# Altium schematic sheet SCC1002_IO.SchDoc
size A4; DrawnBy: Marco
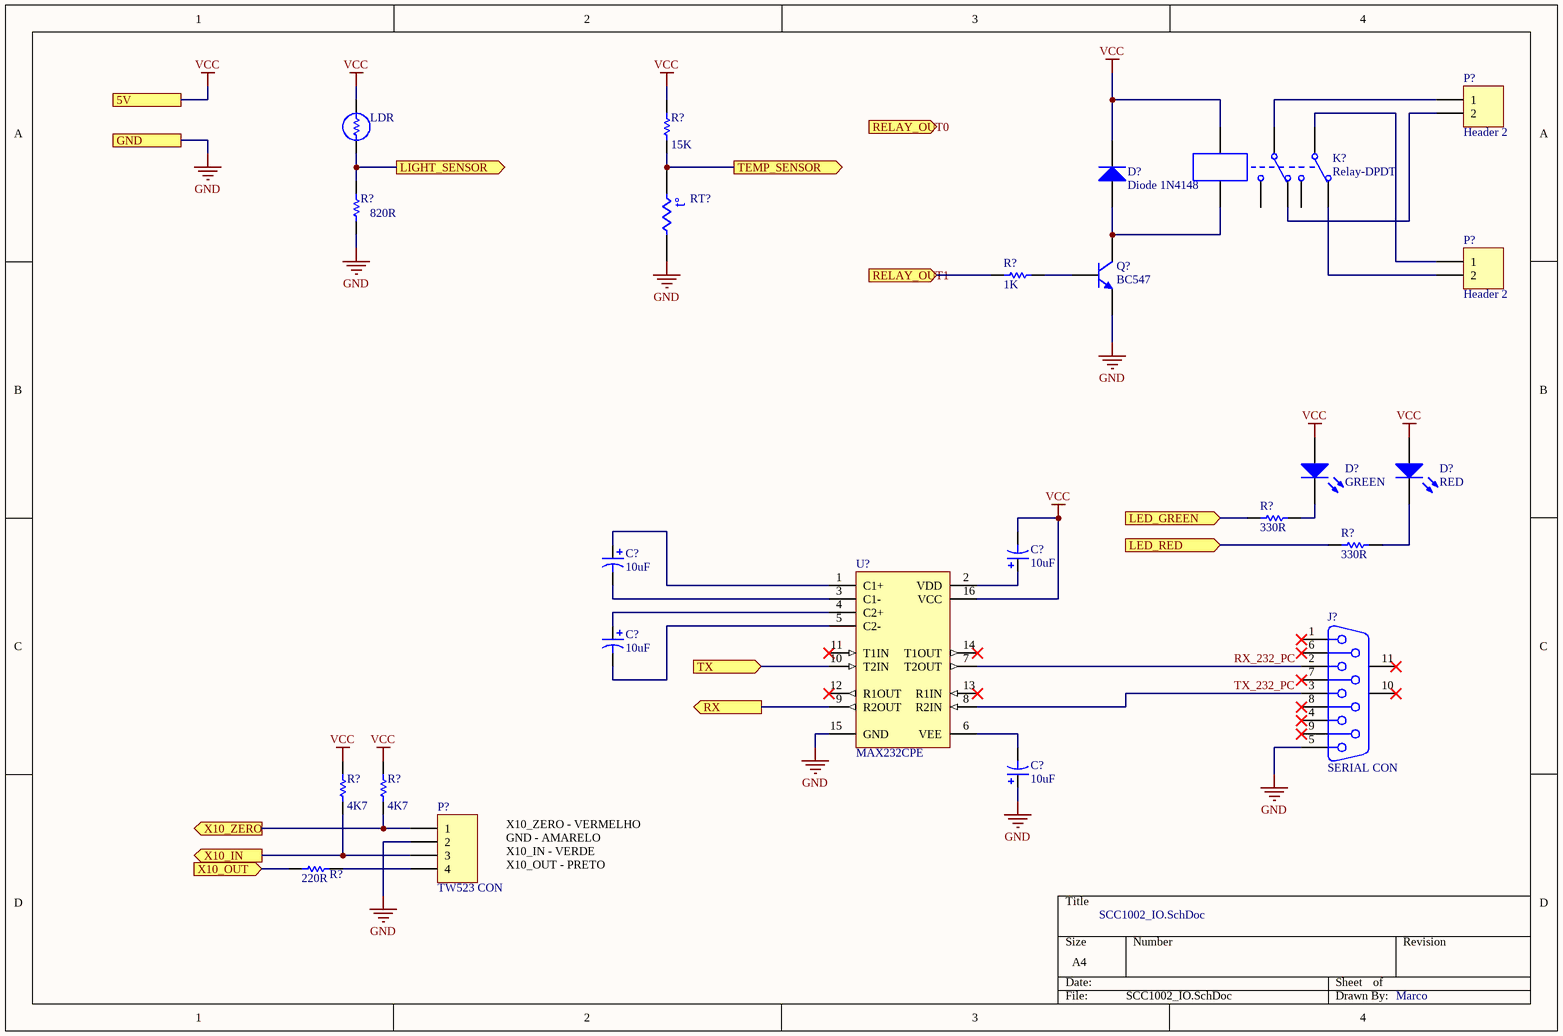
[diagram p0: SCC1002_IO.SchDoc]

## Parts
(Parts that share a designator on the sheet are numbered #1, #2 ... from top to bottom, then left to right.)
C?#1  value 10uF  [RB7.6-15]  (hidden comment: Cap Pol1)
C?#2  value 10uF  [RB7.6-15]  (hidden comment: Cap Pol1)
C?#3  value 10uF  [RB7.6-15]  (hidden comment: Cap Pol1)
C?#4  value 10uF  [RB7.6-15]  (hidden comment: Cap Pol1)
D?#1  Diode 1N4148  [DO-35]
D?#2  GREEN  [3.2X1.6X1.1]
D?#3  RED  [3.2X1.6X1.1]
J?  SERIAL CON  [DSUB1.385-2H9]
K?  Relay-DPDT  [DIP-P8]
LDR  LDR  (value not drawn)
P?#1  Header 2  [HDR1X2]
P?#2  Header 2  [HDR1X2]
P?#3  TW523 CON  [HDR1X4]
Q?  BC547  [TO-92A]
R?#1  value 15K  [AXIAL-0.3]  (hidden comment: Res1)
R?#2  value 820R  [AXIAL-0.3]  (hidden comment: Res1)
R?#3  value 1K  [AXIAL-0.3]  (hidden comment: Res1)
R?#4  value 330R  [AXIAL-0.3]  (hidden comment: Res1)
R?#5  value 330R  [AXIAL-0.3]  (hidden comment: Res1)
R?#6  value 4K7  [AXIAL-0.3]  (hidden comment: Res1)
R?#7  value 4K7  [AXIAL-0.3]  (hidden comment: Res1)
R?#8  value 220R  [AXIAL-0.3]  (hidden comment: Res1)
RT?  Res Thermal  [6-0805_N]  (value not drawn)
U?  MAX232CPE  [PE16A]

## Ports
5V, GND, LED_GREEN (in), LED_RED (in), LIGHT_SENSOR (out), RELAY_OUT0 (in), RELAY_OUT1 (in), RX (out), TEMP_SENSOR (out), TX (in), X10_IN (out), X10_OUT (in), X10_ZERO (out)

## Nets
GND: C?#4.1 J?.5 P?#3.2 Q?.1(E) R?#2.1 RT?.2 U?.15(GND) ; port GND
VCC: C?#2.2 D?#1.2(K) D?#2.1(A) D?#3.1(A) K?.7 LDR.2 R?#1.2 R?#6.2 R?#7.2 U?.16(VCC) ; port 5V
LED_GREEN: R?#4.2 ; port LED_GREEN
LED_RED: R?#5.2 ; port LED_RED
LIGHT_SENSOR: LDR.1 R?#2.2 ; port LIGHT_SENSOR
RELAY_OUT1: R?#3.2 ; port RELAY_OUT1
RX: U?.9(R2OUT) ; port RX
RX_232_PC: J?.2 U?.7(T2OUT)
TEMP_SENSOR: R?#1.1 RT?.1 ; port TEMP_SENSOR
TX: U?.10(T2IN) ; port TX
TX_232_PC: J?.3 U?.8(R2IN)
X10_IN: P?#3.3 R?#6.1 ; port X10_IN
X10_OUT: R?#8.2 ; port X10_OUT
X10_ZERO: P?#3.1 R?#7.1 ; port X10_ZERO
NetC?#1_1: C?#1.1 U?.1(C1+)
NetC?#1_2: C?#1.2 U?.3(C1-)
NetC?#2_1: C?#2.1 U?.2(VDD)
NetC?#3_1: C?#3.1 U?.4(C2+)
NetC?#3_2: C?#3.2 U?.5(C2-)
NetC?#4_2: C?#4.2 U?.6(VEE)
NetD?#1_1: D?#1.1(A) K?.8 Q?.3(C)
NetD?#2_2: D?#2.2(K) R?#4.1
NetD?#3_2: D?#3.2(K) R?#5.1
NetK?_1: K?.1 P?#2.1
NetK?_2: K?.2 P?#2.2
NetK?_4: K?.4 P?#1.1
NetK?_5: K?.5 P?#1.2
NetP?#3_4: P?#3.4 R?#8.1
NetQ?_2: Q?.2(B) R?#3.1

Not connected (* = marked no-connect by the designer): J? 1* 4* 6* 7* 8* 9* 10(MH1)* 11(MH2)*; K? 3 6; U? 11(T1IN)* 12(R1OUT)* 13(R1IN)* 14(T1OUT)*

## Notes on the sheet
- X10_ZERO - VERMELHO
  GND - AMARELO
  X10_IN - VERDE
  X10_OUT - PRETO
- (in symbol Res Thermal) t°

## Library data of the parts
C?#1-C?#4 = Cap Pol1: Polarized Capacitor (Radial); Published: 8-Jun-2000; LatestRevisionDate: 17-Jul-2002; LatestRevisionNote: Re-released for DXP Platform.; PackageReference: RB7.6-15; Publisher: Altium Limited; PackageDescription: Polarized Capacitor (Radial); 2 Leads
D?#1 = Diode 1N4148: High Conductance Fast Diode; Published: 8-Jun-2000; LatestRevisionDate: 17-Jul-2002; LatestRevisionNote: Re-released for DXP Platform.; DatasheetVersion: 1997; PackageReference: DO-35; Publisher: Altium Limited; PackageDescription: Diode, Axial; Body 3.8 x 1.9 mm (LxDia. max), Lead Dia. 0.53 mm (max); Code_JEDEC: DO-204-AH; ComponentLink1Description: Manufacturer Link; ComponentLink1URL: http://www.fairchildsemi.com/; ComponentLink2Description: Datasheet; ComponentLink2URL: http://www.fairchildsemi.com/ds/1N%2F1N4148.pdf
D?#2 D?#3 = LED2: Typical RED, GREEN, YELLOW, AMBER GaAs LED; Published: 8-Jun-2000; LatestRevisionDate: 17-Jul-2002; LatestRevisionNote: Re-released for DXP Platform.; PackageVersion: Feb-2002; PackageReference: 3.2X1.6X1.1; Publisher: Altium Limited; PackageDescription: SM LED; 2 Flat Leads
J? = D Connector 9: Receptacle Assembly, 9 Position, Right Angle; PackageDocument: O; Positions: 9; Published: 15-Jun-2001; LatestRevisionDate: 17-Jul-2002; LatestRevisionNote: Re-released for DXP Platform.; DatasheetDocument: 1-Sep-1999; PackageReference: 788750; Publisher: Altium Limited; Orientation: Right Angle; Gender: Receptacle
K? = Relay-DPDT: Dual-Pole Dual-Throw Relay; Published: 24-Mar-1999; LatestRevisionDate: 17-Jul-2002; LatestRevisionNote: Re-released for DXP Platform.; PackageReference: DIP-P8; Publisher: Altium Limited; PackageDescription: Relay; 8 Leads
LDR = LDR: Light Dependent Resistor
P?#1 P?#2 = Header 2: Header, 2-Pin; LatestRevisionDate: 17-Jul-2002; LatestRevisionNote: Re-released for DXP Platform.; Publisher: Altium Limited
P?#3 = Header 4: Header, 4-Pin; LatestRevisionDate: 17-Jul-2002; LatestRevisionNote: Re-released for DXP Platform.; Publisher: Altium Limited
Q? = 2N3904: NPN General Purpose Amplifier; Published: 8-Jun-2000; LatestRevisionDate: 15-Jan-2003; LatestRevisionNote: PCB Footprint 'BCY-W3/D4.7' replaced; DatasheetVersion: 1997; PackageVersion: Sep-1998; PackageReference: TO-92A; Publisher: Altium Limited; PackageDescription: TO, Flat Index; 3 In-Line, Axial Leads; Body Dia. 4.5mm; Leads 0.51 x 0.48 mm (max); ComponentLink1Description: Manufacturer Link; ComponentLink1URL: http://www.fairchildsemi.com/; ComponentLink2Description: Datasheet; ComponentLink2URL: http://www.fairchildsemi.com/ds/2N%2F2N3904.pdf
R?#1-R?#8 = Res1: Resistor; Published: 8-Jun-2000; LatestRevisionDate: 17-Jul-2002; LatestRevisionNote: Re-released for DXP Platform.; PackageReference: AXIAL-0.3; Publisher: Altium Limited; PackageDescription: Axial Device, Thru-Hole; 2 Leads; 0.3 in Pin Spacing
RT? = Res Thermal: Thermistor; Published: 24-Mar-1999; LatestRevisionDate: 29-May-2009; LatestRevisionNote: IPC-7351 Footprint Added.; PackageVersion: Mar-2003; PackageReference: 6-0805; Publisher: Altium Limited; PackageDescription: Chip Resistor 0805 Case Size; Code_IPC: RESC2012
U? = MAX232CPE: +5V Powered RS-232 Driver/Receiver; Published: 16-Jan-2001; LatestRevisionDate: 29-May-2009; LatestRevisionNote: Component Body Added.; DatasheetVersion: Apr-1992; PackageVersion: 1997; PackageReference: PE16A; Publisher: Altium Limited; PackageDescription: DIP, 16-Pin, Row Spacing 7.62 mm, Pitch 2.54 mm; Code_JEDEC: MS-001-BB; ComponentLink1Description: Manufacturer Link; ComponentLink1URL: http://www.maxim-ic.com/; ComponentLink2Description: Datasheet; ComponentLink2URL: http://pdfserv.maxim-ic.com/en/ds/MAX220-MAX249.pdf